# Altium schematic sheet CAN.SchDoc
size 420 x 297 mm; Revision: 1.1.0; SheetNumber: 8; SheetTotal: 15
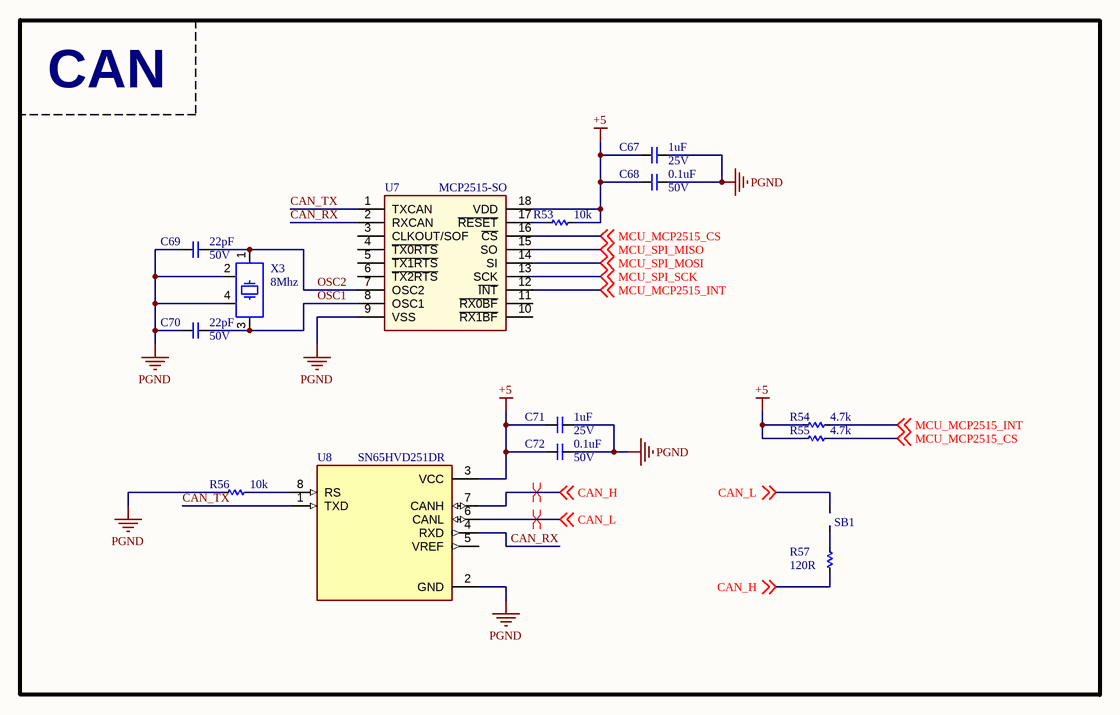
[diagram p0: CAN.SchDoc]

## Parts
C67  1uF  Voltage: 25V  [CAP_C_1608X80]
C68  0.1uF  Voltage: 50V  [CAP_C_1608X80]
C69  22pF  Voltage: 50V  [CAP_C_1608X80]
C70  22pF  Voltage: 50V  [CAP_C_1608X80]
C71  1uF  Voltage: 25V  [CAP_C_1608X80]
C72  0.1uF  Voltage: 50V  [CAP_C_1608X80]
R53  10k  [RES_C_1608X60]
R54  4.7k  [RES_C_1608X60]
R55  4.7k  [RES_C_1608X60]
R56  10k  [RES_C_1608X60]
R57  120R  [RES_C_1608X60]
SB1  N/A  [JUMPER_1608]  (value not drawn)
U7  MCP2515-SO  [SOIC-20]
U8  SN65HVD251DR  [SOIC-8]
X3  8Mhz  [XTAL_3225]

## Blocks framed on the sheet
CAN: C67-C72 R53-R57 SB1 U7 U8 X3

## Nets
+5: C67.1 C68.1 C71.2 C72.1 R53.2 R54.1 R55.1 U7.18(VDD) U8.3(VCC)
PGND: C67.2 C68.2 C69.2 C70.2 C71.1 C72.2 R56.1 U7.9(VSS) U8.2(GND) X3.2 X3.4
CAN_H: R57.1 U8.7(CANH) ; off-sheet CAN_H
CAN_L: SB1.1 U8.6(CANL) ; off-sheet CAN_L
CAN_RX: U7.2(RXCAN) U8.4(RXD)
CAN_TX: U7.1(TXCAN) U8.1(TXD)
MCU_MCP2515_CS: R55.2 U7.16(~{CS}) ; off-sheet MCU_MCP2515_CS
MCU_MCP2515_INT: R54.2 U7.12(~{INT}) ; off-sheet MCU_MCP2515_INT
MCU_SPI_MISO: U7.15(SO) ; off-sheet MCU_SPI_MISO
MCU_SPI_MOSI: U7.14(SI) ; off-sheet MCU_SPI_MOSI
MCU_SPI_SCK: U7.13(SCK) ; off-sheet MCU_SPI_SCK
OSC1: C70.1 U7.8(OSC1) X3.3
OSC2: C69.1 U7.7(OSC2) X3.1
NetR53_1: R53.1 U7.17(~{RESET})
NetR56_2: R56.2 U8.8(RS)
NetR57_2: R57.2 SB1.2

Not connected (* = marked no-connect by the designer): U7 3(CLKOUT/SOF) 4(~{TX0RTS}) 5(~{TX1RTS}) 6(~{TX2RTS}) 10(~{RX1BF}) 11(~{RX0BF}); U8 5(VREF)

## Layout directives
differential pair: CAN_H, CAN_L

## Notes on the sheet
- Project:
- DAL_PDU
- Sub-system:
- IGRVT-50
- Design by:
- KIEN HOANG
- BAO BUI
- Sheet title:
- Sheet
- A3
- of
- Checked by:
- Approved by:
- VU PHAM
- Revision:
- Document No:
- Size:
- Date:

## Library data of the parts
C67-C72 = _CAP_C_2: CAP
R53-R57 = _RES_B_2_2: RES
SB1 = JUMPER
U7 = MCP2515-SO: Stand-Alone CAN Controller with SPI Interface
X3 = crystal_4pin